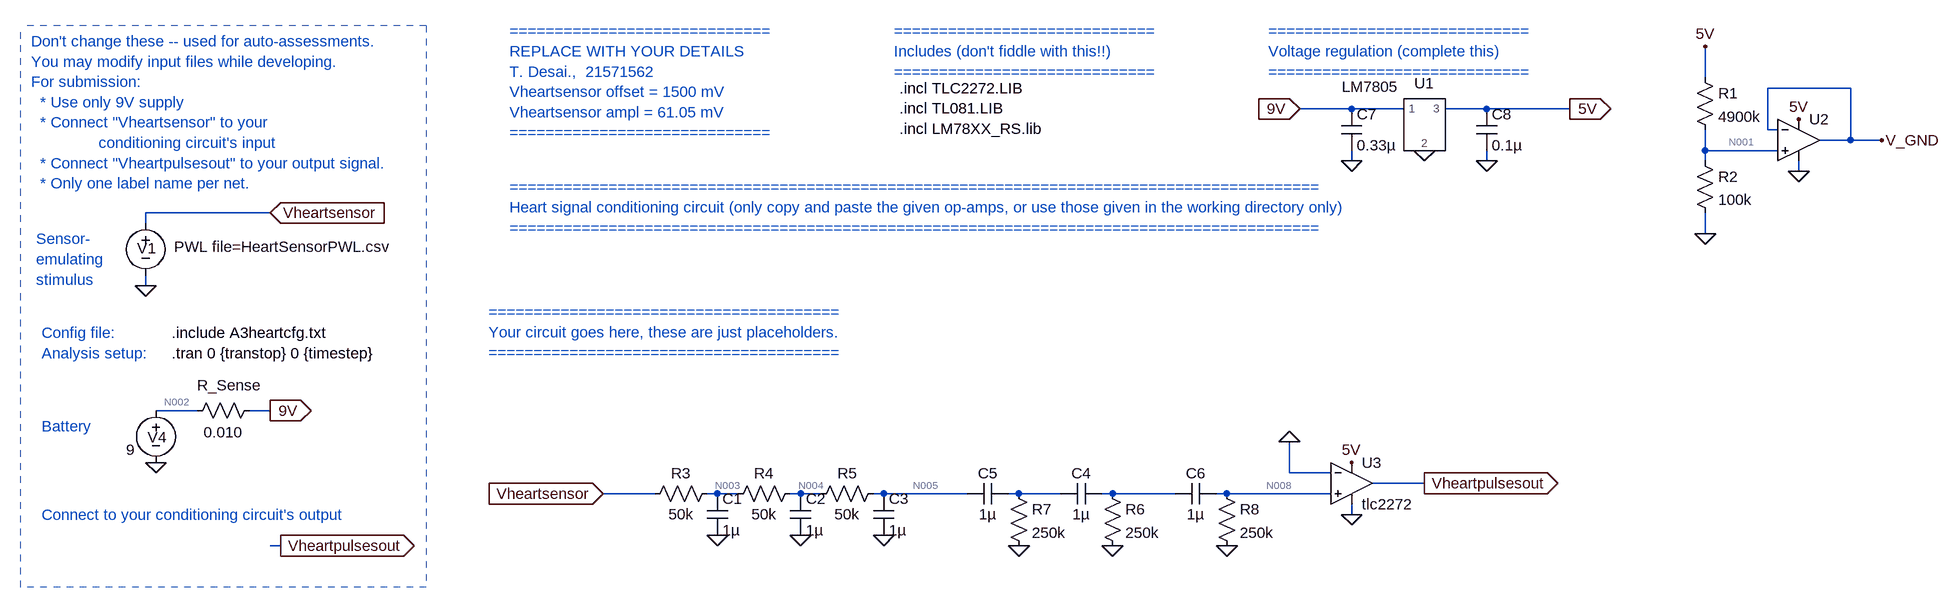
[diagram p0: schematic E344_A3_heart.asc]
E344_A3_heart.asc, the LTspice schematic file:
Version 4
SHEET 1 1824 680
WIRE 288 -1328 288 -1376
WIRE 512 -1312 384 -1312
WIRE -256 -1280 -336 -1280
WIRE -176 -1280 -256 -1280
WIRE -48 -1280 -112 -1280
WIRE 80 -1280 -48 -1280
WIRE 384 -1248 384 -1312
WIRE 400 -1248 384 -1248
WIRE 512 -1232 512 -1312
WIRE 512 -1232 464 -1232
WIRE 560 -1232 512 -1232
WIRE 288 -1216 288 -1248
WIRE 400 -1216 288 -1216
WIRE -256 -1200 -256 -1216
WIRE -48 -1200 -48 -1216
WIRE 288 -1200 288 -1216
WIRE 432 -1184 432 -1200
WIRE -1920 -1120 -2112 -1120
WIRE -2112 -1104 -2112 -1120
WIRE 288 -1088 288 -1120
WIRE -2112 -1008 -2112 -1024
WIRE -2032 -816 -2096 -816
WIRE -1920 -816 -1952 -816
WIRE -352 -720 -352 -768
WIRE -288 -720 -352 -720
WIRE -144 -704 -224 -704
WIRE -1328 -688 -1408 -688
WIRE -1232 -688 -1248 -688
WIRE -1200 -688 -1232 -688
WIRE -1104 -688 -1120 -688
WIRE -1072 -688 -1104 -688
WIRE -976 -688 -992 -688
WIRE -848 -688 -976 -688
WIRE -768 -688 -784 -688
WIRE -704 -688 -768 -688
WIRE -624 -688 -640 -688
WIRE -528 -688 -624 -688
WIRE -448 -688 -464 -688
WIRE -288 -688 -448 -688
WIRE -256 -656 -256 -672
WIRE -1904 -608 -1920 -608
FLAG -2112 -1008 0
FLAG -1920 -1120 Vheartsensor
IOPIN -1920 -1120 In
FLAG -1920 -816 9V
IOPIN -1920 -816 Out
FLAG -2096 -736 0
FLAG -336 -1280 9V
IOPIN -336 -1280 In
FLAG -144 -1216 0
FLAG 80 -1280 5V
IOPIN 80 -1280 Out
FLAG -1904 -608 Vheartpulsesout
IOPIN -1904 -608 Out
FLAG -1408 -688 Vheartsensor
IOPIN -1408 -688 In
FLAG -144 -704 Vheartpulsesout
IOPIN -144 -704 Out
FLAG 432 -1184 0
FLAG 432 -1264 5V
FLAG 288 -1088 0
FLAG 288 -1376 5V
FLAG 560 -1232 V_GND
FLAG -256 -656 0
FLAG -256 -736 5V
FLAG -1232 -624 0
FLAG -1104 -624 0
FLAG -976 -624 0
FLAG -624 -608 0
FLAG -768 -608 0
FLAG -352 -768 0
FLAG -448 -608 0
FLAG -256 -1200 0
FLAG -48 -1200 0
SYMBOL voltage -2112 -1120 R0
WINDOW 123 0 0 Left 0
WINDOW 39 0 0 Left 0
WINDOW 3 44 52 Left 2
WINDOW 0 -13 54 Left 2
SYMATTR Value PWL file=HeartSensorPWL.csv
SYMATTR InstName V1
SYMBOL voltage -2096 -832 R0
WINDOW 123 24 44 Left 2
WINDOW 39 0 0 Left 0
WINDOW 3 -46 76 Left 2
WINDOW 0 -13 57 Left 2
SYMATTR Value 9
SYMATTR InstName V4
SYMBOL res -1936 -832 R90
WINDOW 0 -7 47 VBottom 2
WINDOW 3 34 56 VTop 2
SYMATTR InstName R_Sense
SYMATTR Value 0.010
SYMBOL LM7805 -144 -1264 R0
WINDOW 3 -83 -66 Top 2
SYMATTR InstName U1
SYMBOL Opamps\\UniversalOpamp2 432 -1232 R0
SYMATTR InstName U2
SYMBOL res 272 -1344 R0
SYMATTR InstName R1
SYMATTR Value 4900k
SYMBOL res 272 -1216 R0
SYMATTR InstName R2
SYMATTR Value 100k
SYMBOL Opamps\\opamp2 -256 -768 R0
SYMATTR InstName U3
SYMATTR Value tlc2272
SYMBOL res -1232 -704 R90
WINDOW 0 0 56 VBottom 2
WINDOW 3 32 56 VTop 2
SYMATTR InstName R3
SYMATTR Value 50k
SYMBOL cap -1248 -688 R0
SYMATTR InstName C1
SYMATTR Value 1µ
SYMBOL res -1104 -704 R90
WINDOW 0 0 56 VBottom 2
WINDOW 3 32 56 VTop 2
SYMATTR InstName R4
SYMATTR Value 50k
SYMBOL cap -1120 -688 R0
SYMATTR InstName C2
SYMATTR Value 1µ
SYMBOL res -976 -704 R90
WINDOW 0 0 56 VBottom 2
WINDOW 3 32 56 VTop 2
SYMATTR InstName R5
SYMATTR Value 50k
SYMBOL cap -992 -688 R0
SYMATTR InstName C3
SYMATTR Value 1µ
SYMBOL res -640 -704 R0
SYMATTR InstName R6
SYMATTR Value 250k
SYMBOL cap -704 -672 R270
WINDOW 0 32 32 VTop 2
WINDOW 3 0 32 VBottom 2
SYMATTR InstName C4
SYMATTR Value 1µ
SYMBOL res -784 -704 R0
SYMATTR InstName R7
SYMATTR Value 250k
SYMBOL cap -848 -672 R270
WINDOW 0 32 32 VTop 2
WINDOW 3 0 32 VBottom 2
SYMATTR InstName C5
SYMATTR Value 1µ
SYMBOL res -464 -704 R0
SYMATTR InstName R8
SYMATTR Value 250k
SYMBOL cap -528 -672 R270
WINDOW 0 32 32 VTop 2
WINDOW 3 0 32 VBottom 2
SYMATTR InstName C6
SYMATTR Value 1µ
SYMBOL cap -272 -1280 R0
SYMATTR InstName C7
SYMATTR Value 0.33µ
SYMBOL cap -64 -1280 R0
SYMATTR InstName C8
SYMATTR Value 0.1µ
TEXT -2072 -904 Left 2 !.tran 0 {transtop} 0 {timestep}
TEXT -2072 -936 Left 2 !.include A3heartcfg.txt
TEXT -2288 -1384 Left 2 ;Don't change these -- used for auto-assessments.\nYou may modify input files while developing.\nFor submission: \n  * Use only 9V supply \n  * Connect "Vheartsensor" to your \n               conditioning circuit's input\n  * Connect "Vheartpulsesout" to your output signal.\n  * Only one label name per net.
TEXT -2272 -936 Left 2 ;Config file:
TEXT -2272 -904 Left 2 ;Analysis setup:
TEXT -2272 -792 Left 2 ;Battery
TEXT -2280 -1080 Left 2 ;Sensor-\nemulating \nstimulus
TEXT -1552 -1400 Left 2 ;=============================\nREPLACE WITH YOUR DETAILS\nT. Desai.,  21571562\nVheartsensor offset = 1500 mV\nVheartsensor ampl = 61.05 mV\n=============================
TEXT -1552 -1160 Left 2 ;==========================================================================================\nHeart signal conditioning circuit (only copy and paste the given op-amps, or use those given in the working directory only)\n==========================================================================================
TEXT -384 -1400 Left 2 ;=============================\nVoltage regulation (complete this)\n=============================
TEXT -952 -1312 Left 2 !.incl TLC2272.LIB\n.incl TL081.LIB\n.incl LM78XX_RS.lib
TEXT -2272 -656 Left 2 ;Connect to your conditioning circuit's output
TEXT -960 -1400 Left 2 ;=============================\nIncludes (don't fiddle with this!!)\n=============================
TEXT -1584 -968 Left 2 ;=======================================\nYour circuit goes here, these are just placeholders.\n=======================================
LINE Normal -2304 -544 -2304 -1408 1
LINE Normal -1680 -1408 -1680 -544 1
LINE Normal -1680 -544 -2304 -544 1
LINE Normal -1680 -1408 -2304 -1408 1

The netlist it stands for:
* E344_A3_heart.asc
V1 Vheartsensor 0 PWL file=HeartSensorPWL.csv
V4 N002 0 9
R_Sense 9V N002 0.010
XU1 9V 0 5V LM7805  ; pins 1 2 3
XU2 N001 V_GND 5V 0 V_GND level.2 Avol=1Meg GBW=10Meg Slew=10Meg ilimit=25m rail=0 Vos=0 phimargin=45 en=0 enk=0 in=0 ink=0 Rin=500Meg  ; pins IN+ IN- V+ V- OUT
R1 5V N001 4900k
R2 N001 0 100k
XU3 N008 0 5V 0 Vheartpulsesout tlc2272  ; pins In+ In- V+ V- OUT
R3 N003 Vheartsensor 50k
C1 N003 0 1µ
R4 N004 N003 50k
C2 N004 0 1µ
R5 N005 N004 50k
C3 N005 0 1µ
R6 N007 0 250k
C4 N006 N007 1µ
R7 N006 0 250k
C5 N005 N006 1µ
R8 N008 0 250k
C6 N007 N008 1µ
C7 9V 0 0.33µ
C8 5V 0 0.1µ
.tran 0 {transtop} 0 {timestep}
.include A3heartcfg.txt
* Don't change these -- used for auto-assessments.
* You may modify input files while developing.
* For submission:
*   * Use only 9V supply
*   * Connect "Vheartsensor" to your
*                conditioning circuit's input
*   * Connect "Vheartpulsesout" to your output signal.
*   * Only one label name per net.
* Config file:
* Analysis setup:
* Battery
* Sensor-
* emulating
* stimulus
* =============================
* REPLACE WITH YOUR DETAILS
* T. Desai.,  21571562
* Vheartsensor offset = 1500 mV
* Vheartsensor ampl = 61.05 mV
* =============================
* ==========================================================================================
* Heart signal conditioning circuit (only copy and paste the given op-amps, or use those given in the working directory only)
* ==========================================================================================
* =============================
* Voltage regulation (complete this)
* =============================
.incl TLC2272.LIB
.incl TL081.LIB
.incl LM78XX_RS.lib
* Connect to your conditioning circuit's output
* =============================
* Includes (don't fiddle with this!!)
* =============================
* =======================================
* Your circuit goes here, these are just placeholders.
* =======================================
.lib LM78XX_RS.lib
.lib UniversalOpamps2.sub
.backanno
.end

* Results of the author's LTspice run, read from the files saved beside the schematic
* Operating Point, zero values left out:
*   V(vheartsensor) = 1.494 V
*   V(n002) = 9 V
*   V(9v) = 9 V
*   V(5v) = 5.003 V
*   V(v_gnd) = 100.5 mV
*   V(n001) = 100.5 mV
*   V(vheartpulsesout) = 4.994 V
*   V(n008) = 2.252 µV
*   V(n003) = 1.494 V
*   V(n004) = 1.494 V
*   V(n005) = 1.494 V
*   I(R8) = 9.006 pA
*   I(R2) = 1.005 µA
*   I(R1) = 1 µA
*   I(R_sense) = -7.492 mA
*   I(V4) = -7.492 mA
*   Ix(u1:1) = 7.492 mA
*   Ix(u1:2) = -5.021 mA
*   Ix(u1:3) = -2.471 mA
*   Ix(u2:1) = -4.802 nA
*   Ix(u2:2) = -4.802 nA
*   Ix(u2:3) = 70.23 µA
*   Ix(u2:4) = -70.2 µA
*   Ix(u2:5) = 4.802 nA
*   Ix(u3:IN+) = -9.006 pA
*   Ix(u3:IN-) = -9.506 pA
*   Ix(u3:VCC) = 2.4 mA
*   Ix(u3:VEE) = -2.4 mA
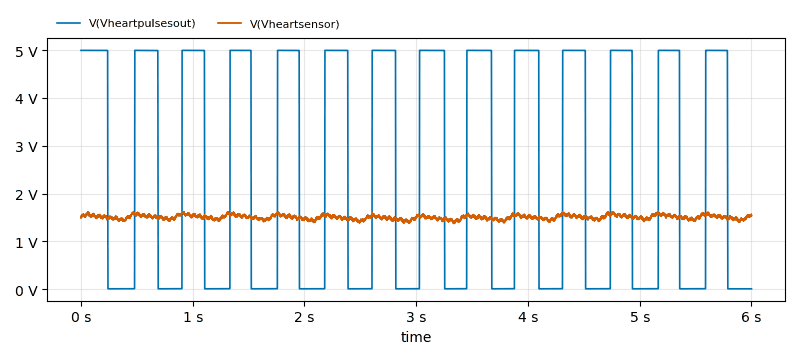
[diagram p1: Transient Analysis of E344_A3_heart.asc, plotted from the saved traces]
* Transient Analysis, 1 run:
*   V(Vheartpulsesout): min 9.15 mV, max 4.994 V, average 2.423 V, rms 3.47 V, last 9.153 mV
*   V(Vheartsensor): min 1.376 V, max 1.631 V, average 1.505 V, rms 1.506 V, last 1.534 V